# Altium project PID_and_Motor_Driver.PrjPcb
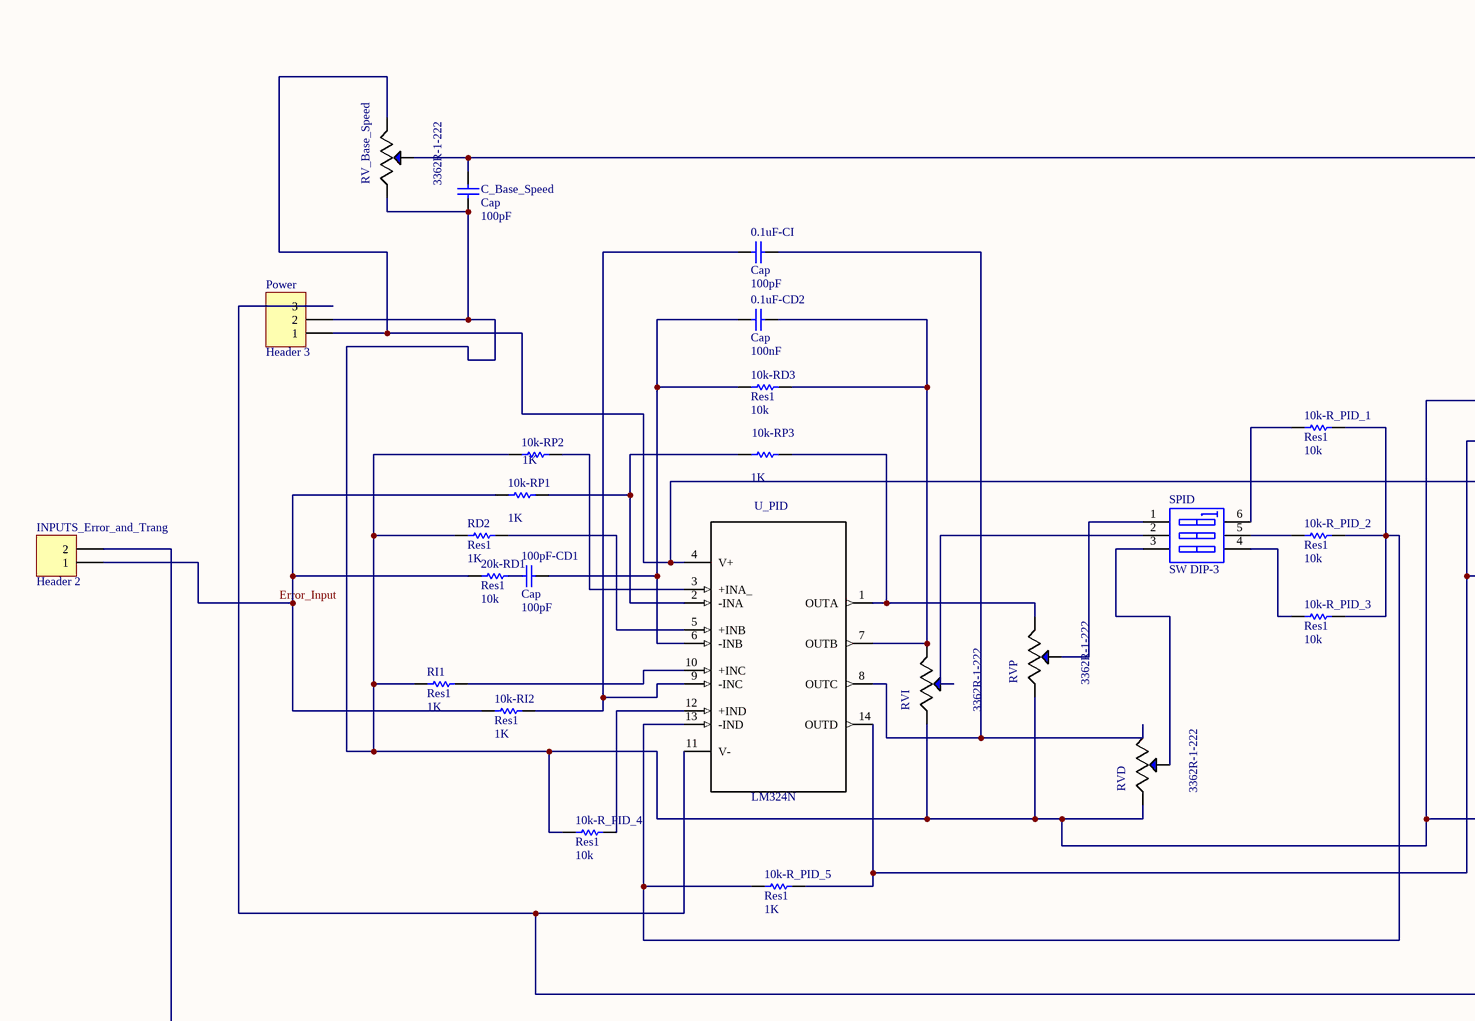
[diagram p0: PID.SchDoc, left]
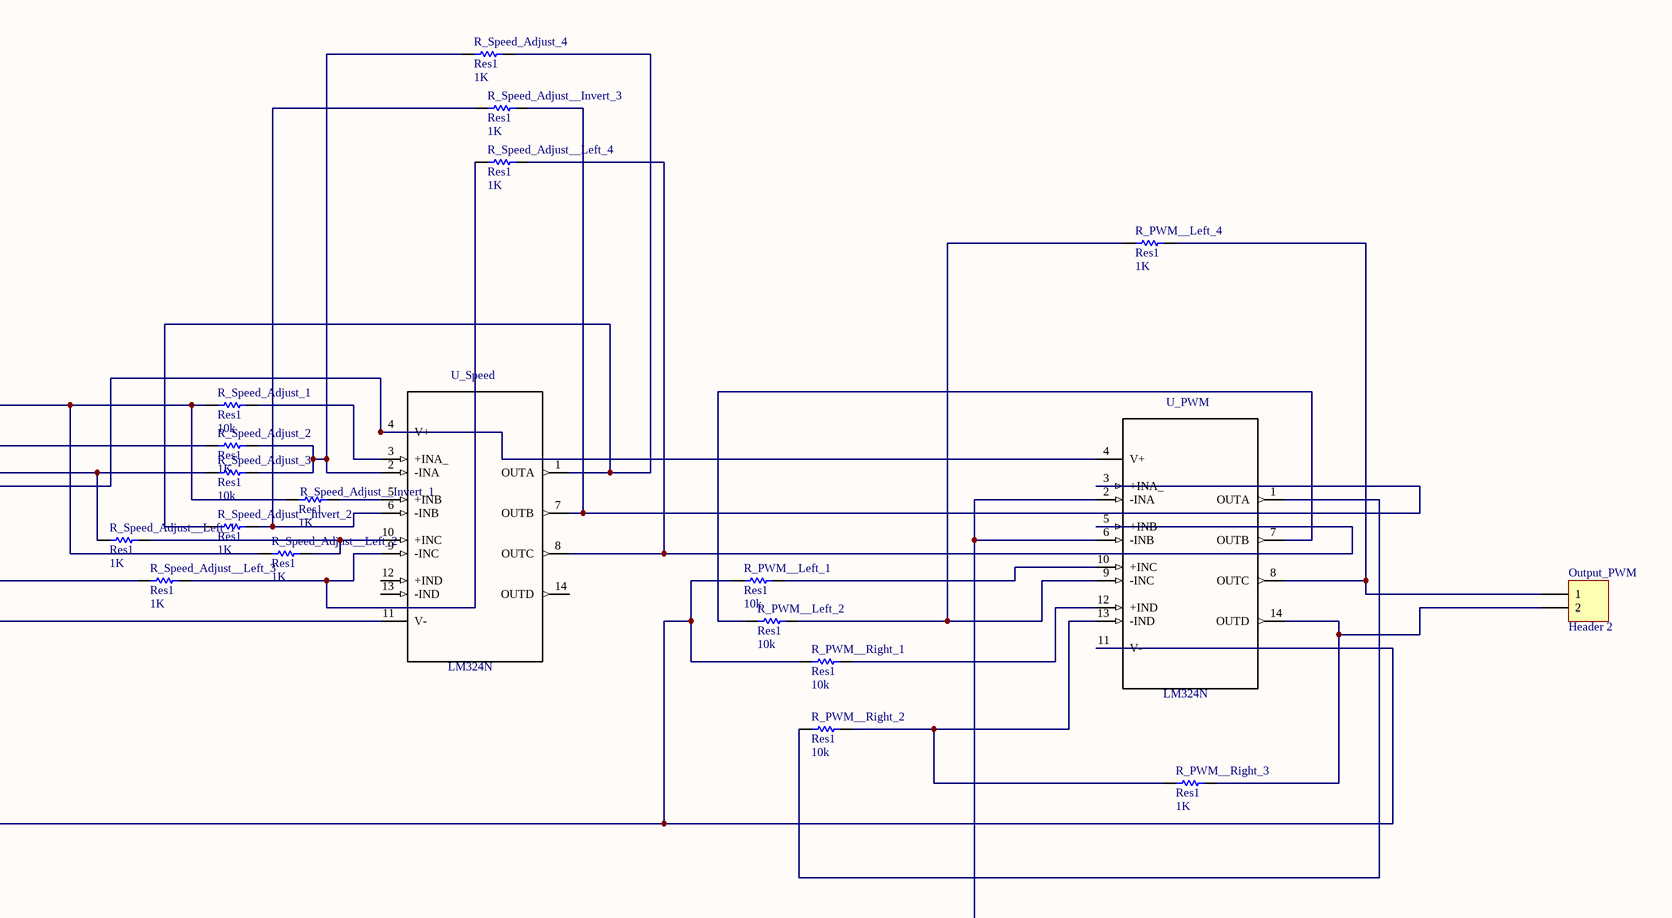
[diagram p1: PID.SchDoc, right]
1 sheet, 45 parts. Net scope: global (net labels, ports and power ports of the same name join across sheets).
Board files: AT long bus (13.3 x 4.2 inches).PCBDOC, PID.PcbDoc

## Sheet PID.SchDoc
size A0

### Parts
0.1uF-CD2  Cap  value 100nF  [RAD-0.3]
0.1uF-CI  Cap  value 100pF  [RAD-0.3]
10k-R_PID_1  Res1  value 10k  [AXIAL-0.3]
10k-R_PID_2  Res1  value 10k  [AXIAL-0.3]
10k-R_PID_3  Res1  value 10k  [AXIAL-0.3]
10k-R_PID_4  Res1  value 10k  [AXIAL-0.3]
10k-R_PID_5  Res1  value 1K  [AXIAL-0.3]
10k-RD3  Res1  value 10k  [AXIAL-0.3]
10k-RI2  Res1  value 1K  [AXIAL-0.3]
10k-RP1  value 1K  [AXIAL-0.3]
10k-RP2  value 1K  [AXIAL-0.3]
10k-RP3  value 1K  [AXIAL-0.3]
20k-RD1  Res1  value 10k  [AXIAL-0.3]
100pF-CD1  Cap  value 100pF  [RAD-0.3]
C_Base_Speed  Cap  value 100pF  [RAD-0.3]
INPUTS_Error_and_Trang  Header 2  [HDR1X2]
Output_PWM  Header 2  [HDR1X2]
Power  Header 3  [HDR1X3]
R_PWM__Left_1  Res1  value 10k  [AXIAL-0.3]
R_PWM__Left_2  Res1  value 10k  [AXIAL-0.3]
R_PWM__Left_4  Res1  value 1K  [AXIAL-0.3]
R_PWM__Right_1  Res1  value 10k  [AXIAL-0.3]
R_PWM__Right_2  Res1  value 10k  [AXIAL-0.3]
R_PWM__Right_3  Res1  value 1K  [AXIAL-0.3]
R_Speed_Adjust_1  Res1  value 10k  [AXIAL-0.3]
R_Speed_Adjust_2  Res1  value 1K  [AXIAL-0.3]
R_Speed_Adjust_3  Res1  value 10k  [AXIAL-0.3]
R_Speed_Adjust_4  Res1  value 1K  [AXIAL-0.3]
R_Speed_Adjust__Invert_1  Res1  value 1K  [AXIAL-0.3]
R_Speed_Adjust__Invert_2  Res1  value 1K  [AXIAL-0.3]
R_Speed_Adjust__Invert_3  Res1  value 1K  [AXIAL-0.3]
R_Speed_Adjust__Left_1  Res1  value 1K  [AXIAL-0.3]
R_Speed_Adjust__Left_2  Res1  value 1K  [AXIAL-0.3]
R_Speed_Adjust__Left_3  Res1  value 1K  [AXIAL-0.3]
R_Speed_Adjust__Left_4  Res1  value 1K  [AXIAL-0.3]
RD2  Res1  value 1K  [AXIAL-0.3]
RI1  Res1  value 1K  [AXIAL-0.3]
RV_Base_Speed  3362R-1-222  [*TRIM_3362R-1-222]
RVD  3362R-1-222  [*TRIM_3362R-1-222]
RVI  3362R-1-222  [*TRIM_3362R-1-222]
RVP  3362R-1-222  [*TRIM_3362R-1-222]
SPID  SW DIP-3  [DIP-6]
U_PID  LM324N  [*DIP254P762X508-14]
U_PWM  LM324N  [*DIP254P762X508-14]
U_Speed  LM324N  [*DIP254P762X508-14]

### Nets
Error_Input: 10k-RI2.1 10k-RP1.1 20k-RD1.1 INPUTS_Error_and_Trang.1
Net0.1uF-CD2_1: 0.1uF-CD2.1 10k-RD3.1 100pF-CD1.2 U_PID.6(-INB)
Net0.1uF-CD2_2: 0.1uF-CD2.2 10k-RD3.2 RVI.3(CW) U_PID.7(OUTB)
Net0.1uF-CI_1: 0.1uF-CI.1 10k-RI2.2 U_PID.9(-INC)
Net0.1uF-CI_2: 0.1uF-CI.2 RVD.3(CW) U_PID.8(OUTC)
Net10k-R_PID_1_1: 10k-R_PID_1.1 SPID.6(B1)
Net10k-R_PID_1_2: 10k-R_PID_1.2 10k-R_PID_2.2 10k-R_PID_3.2 10k-R_PID_5.1 U_PID.13(-IND)
Net10k-R_PID_2_1: 10k-R_PID_2.1 SPID.5(B2)
Net10k-R_PID_3_1: 10k-R_PID_3.1 SPID.4(B3)
Net10k-R_PID_4_1: 10k-R_PID_4.1 10k-RP2.1 C_Base_Speed.1 Power.2 R_PWM__Left_1.1 R_PWM__Right_1.1 R_Speed_Adjust_1.1 R_Speed_Adjust__Invert_1.1 R_Speed_Adjust__Left_2.1 RD2.1 RI1.1 RV_Base_Speed.1(CCW) RVD.1(CCW) RVI.1(CCW) RVP.1(CCW) U_PWM.11(V-)
Net10k-R_PID_4_2: 10k-R_PID_4.2 U_PID.12(+IND)
Net10k-R_PID_5_2: 10k-R_PID_5.2 R_Speed_Adjust_2.1 R_Speed_Adjust__Left_3.1 U_PID.14(OUTD)
Net10k-RP1_2: 10k-RP1.2 10k-RP3.1 U_PID.2(-INA)
Net10k-RP2_2: 10k-RP2.2 U_PID.3(+INA_)
Net10k-RP3_2: 10k-RP3.2 RVP.3(CW) U_PID.1(OUTA)
Net20k-RD1_2: 20k-RD1.2 100pF-CD1.1
NetC_Base_Speed_2: C_Base_Speed.2 R_Speed_Adjust_3.1 R_Speed_Adjust__Left_1.1 RV_Base_Speed.2(WIPER)
NetINPUTS_Error_and_Trang_2: INPUTS_Error_and_Trang.2 U_PWM.2(-INA) U_PWM.6(-INB)
NetOutput_PWM_1: Output_PWM.1 R_PWM__Left_4.2 U_PWM.8(OUTC)
NetOutput_PWM_2: Output_PWM.2 R_PWM__Right_3.2 U_PWM.14(OUTD)
NetPower_1: Power.1 RV_Base_Speed.3(CW) U_PID.4(V+) U_PWM.4(V+) U_Speed.4(V+)
NetPower_3: Power.3 U_PID.11(V-) U_Speed.11(V-)
NetR_PWM__Left_1_2: R_PWM__Left_1.2 U_PWM.10(+INC)
NetR_PWM__Left_2_1: R_PWM__Left_2.1 U_PWM.7(OUTB)
NetR_PWM__Left_2_2: R_PWM__Left_2.2 R_PWM__Left_4.1 U_PWM.9(-INC)
NetR_PWM__Right_1_2: R_PWM__Right_1.2 U_PWM.12(+IND)
NetR_PWM__Right_2_1: R_PWM__Right_2.1 U_PWM.1(OUTA)
NetR_PWM__Right_2_2: R_PWM__Right_2.2 R_PWM__Right_3.1 U_PWM.13(-IND)
NetR_Speed_Adjust_1_2: R_Speed_Adjust_1.2 U_Speed.3(+INA_)
NetR_Speed_Adjust_2_2: R_Speed_Adjust_2.2 R_Speed_Adjust_3.2 R_Speed_Adjust_4.1 U_Speed.2(-INA)
NetR_Speed_Adjust_4_2: R_Speed_Adjust_4.2 R_Speed_Adjust__Invert_2.1 U_Speed.1(OUTA)
NetR_Speed_Adjust__Invert_1_2: R_Speed_Adjust__Invert_1.2 U_Speed.5(+INB)
NetR_Speed_Adjust__Invert_2_2: R_Speed_Adjust__Invert_2.2 R_Speed_Adjust__Invert_3.1 U_Speed.6(-INB)
NetR_Speed_Adjust__Invert_3_2: R_Speed_Adjust__Invert_3.2 U_PWM.3(+INA_) U_Speed.7(OUTB)
NetR_Speed_Adjust__Left_1_2: R_Speed_Adjust__Left_1.2 R_Speed_Adjust__Left_2.2 U_Speed.10(+INC)
NetR_Speed_Adjust__Left_3_2: R_Speed_Adjust__Left_3.2 R_Speed_Adjust__Left_4.1 U_Speed.9(-INC)
NetR_Speed_Adjust__Left_4_2: R_Speed_Adjust__Left_4.2 U_PWM.5(+INB) U_Speed.8(OUTC)
NetRD2_2: RD2.2 U_PID.5(+INB)
NetRI1_2: RI1.2 U_PID.10(+INC)
NetRVD_2: RVD.2(WIPER) SPID.3(A3)
NetRVI_2: RVI.2(WIPER) SPID.2(A2)
NetRVP_2: RVP.2(WIPER) SPID.1(A1)

Not connected (* = marked no-connect by the designer): U_Speed 12(+IND) 13(-IND) 14(OUTD)

### Library data of the parts
0.1uF-CD2 0.1uF-CI 100pF-CD1 C_Base_Speed = Cap: Capacitor; Published: 8-Jun-2000; LatestRevisionDate: 17-Jul-2002; LatestRevisionNote: Re-released for DXP Platform.; PackageReference: RAD-0.3; Publisher: Altium Limited; PackageDescription: Radial Cap, Thru-Hole; 2 Leads; 0.3 in Pin Spacing
10k-R_PID_1-10k-R_PID_5 10k-RD3 10k-RI2 10k-RP1-10k-RP3 20k-RD1 R_PWM__Left_1 R_PWM__Left_2 R_PWM__Left_4 R_PWM__Right_1-R_PWM__Right_3 R_Speed_Adjust_1-R_Speed_Adjust_4 R_Speed_Adjust__Invert_1-R_Speed_Adjust__Invert_3 R_Speed_Adjust__Left_1-R_Speed_Adjust__Left_4 RD2 RI1 = Res1: Resistor; Published: 8-Jun-2000; LatestRevisionDate: 17-Jul-2002; LatestRevisionNote: Re-released for DXP Platform.; PackageReference: AXIAL-0.3; Publisher: Altium Limited; PackageDescription: Axial Device, Thru-Hole; 2 Leads; 0.3 in Pin Spacing
INPUTS_Error_and_Trang Output_PWM = Header 2: Header, 2-Pin; LatestRevisionDate: 17-Jul-2002; LatestRevisionNote: Re-released for DXP Platform.; Publisher: Altium Limited
Power = Header 3: Header, 3-Pin; LatestRevisionDate: 17-Jul-2002; LatestRevisionNote: Re-released for DXP Platform.; Publisher: Altium Limited
RV_Base_Speed RVD RVI RVP = 3362R-1-222: Trimpot 2.2k Ohm 1/4 Sq Cer St; MF: Bourns; SnapEDA_Link: https://www.snapeda.com/parts/3362R-1-222/Bourns/view-part/?ref=snap; Package: 2220 Bourns; Availability: Unavailable; Price: None; MP: 3362R-1-222; Value: *
SPID = SW DIP-3: DIP Switch, 3 Position, SPST; Published: 24-Mar-1999; LatestRevisionDate: 17-Jul-2002; LatestRevisionNote: Re-released for DXP Platform.; PackageReference: DIP-6; Publisher: Altium Limited; Code_JEDEC: MO-001-AM
U_PID U_PWM U_Speed = LM324N: OP Amp Quad GP ?15V/30V 14-Pin PDIP Tube; MF: ON Semiconductor; Package: DIP-14 STMicroelectronics; SnapEDA_Link: https://www.snapeda.com/parts/LM324N/ON%20Semiconductor/view-part/?ref=snap; Price: None; Availability: Unavailable; MP: LM324N; Value: *